# EAGLE design axiom_beta_power_adapter (EAGLE 7.0.0)
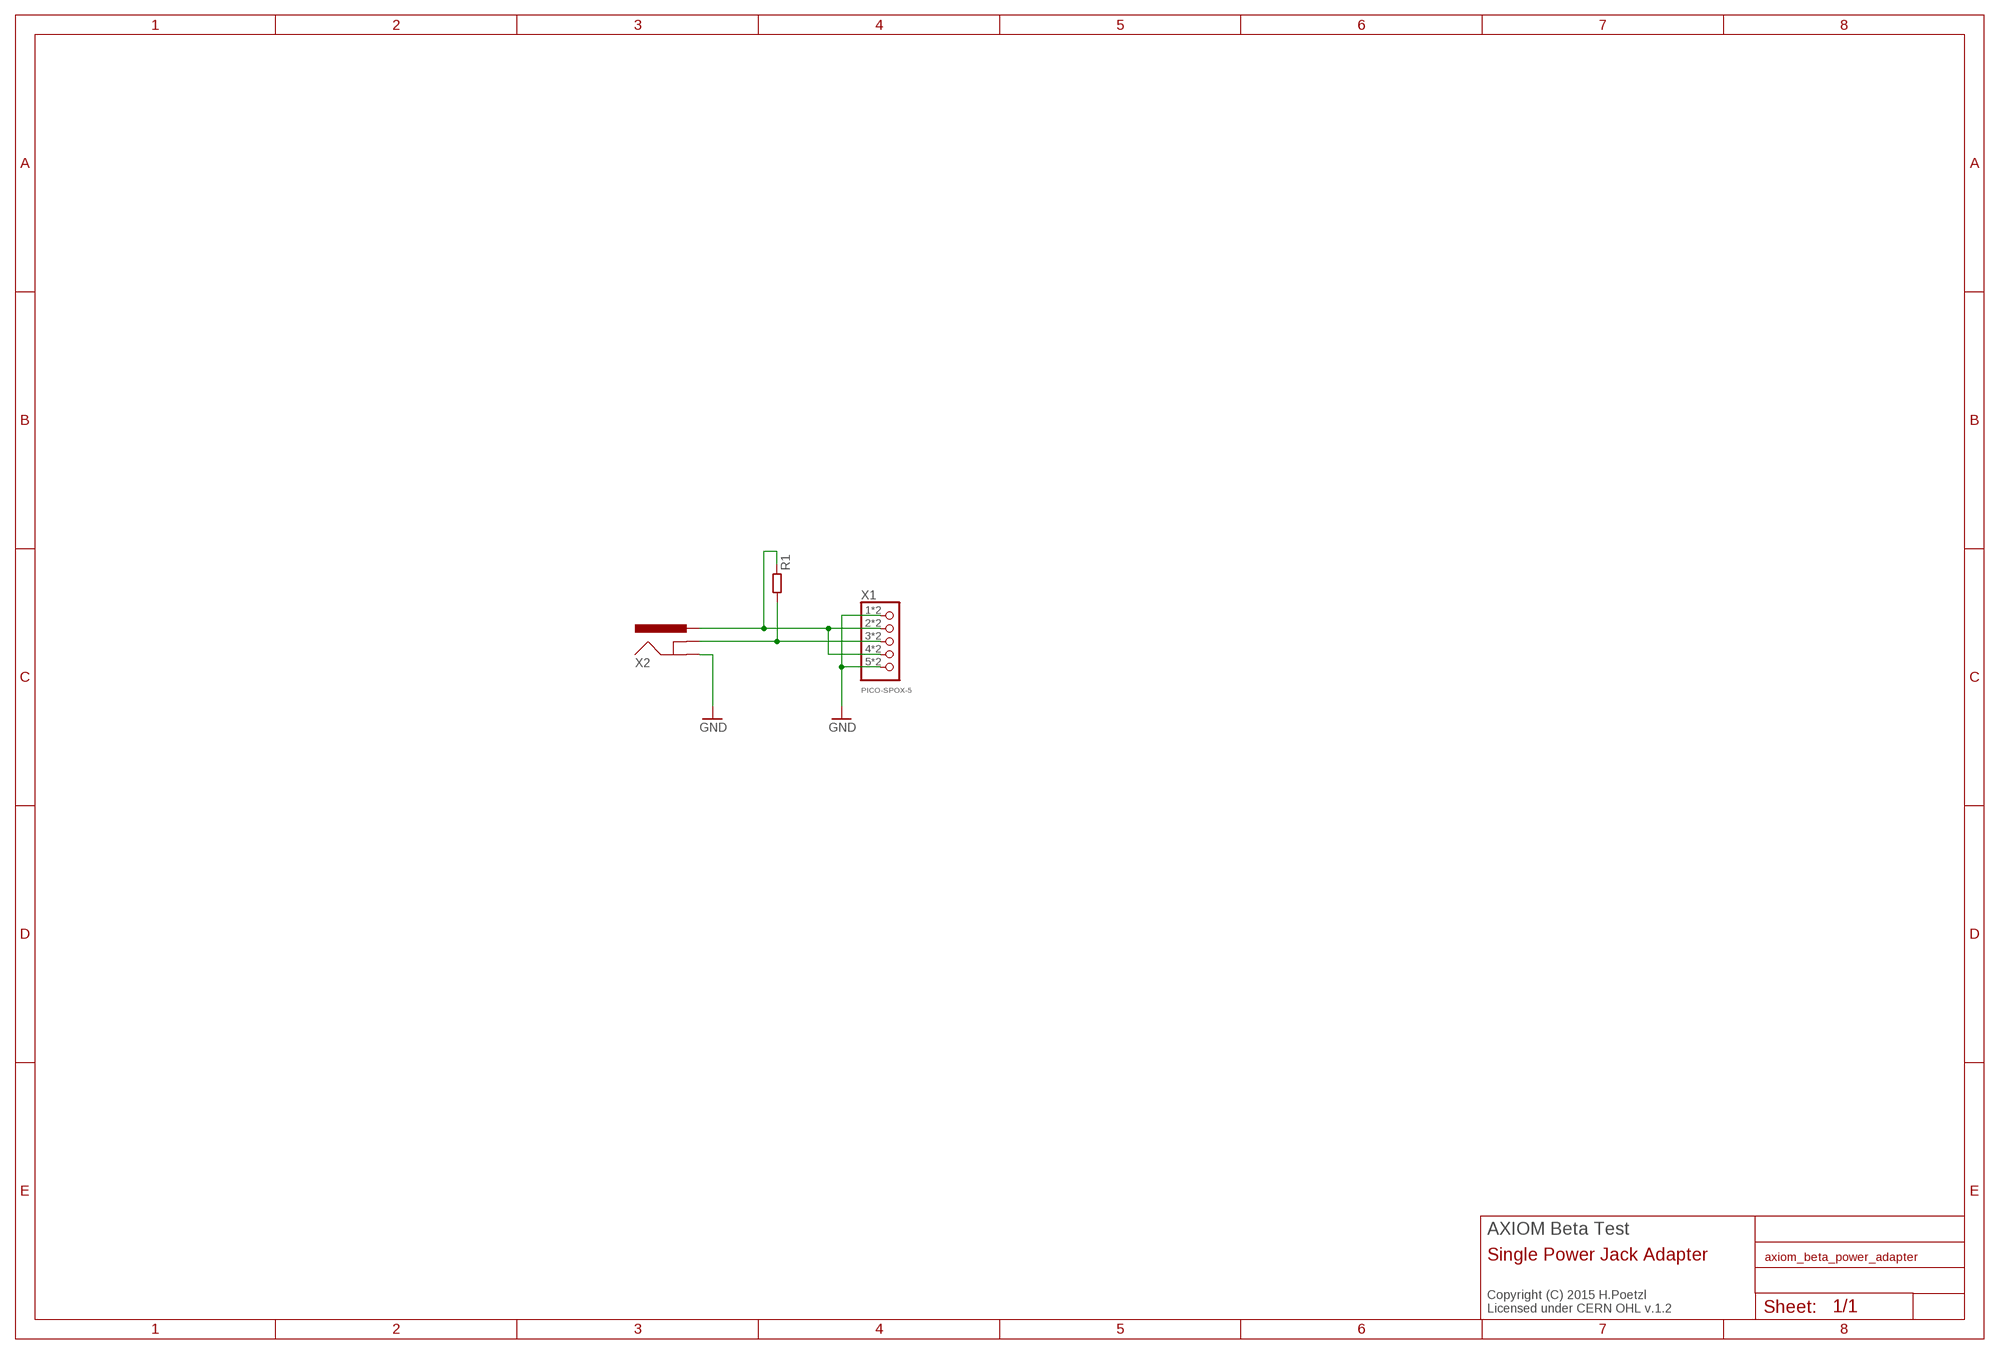
[diagram p0: schematic, sheet 1]

## Parts
R1  R0402-B  [0402-B]
X1  PICO-SPOX-5  [PICO-SPOX-5]
X2  POWER_JACKPTH_N  [POWER_JACK_PTH_NARROW]

## Nets
BETA_5V: R1.1 X1.2 X1.2A X1.4 X1.4A X2.PWR
GND: X1.1 X1.1A X1.5 X1.5A X2.GND
VIN: R1.2 X1.3 X1.3A X2.SHUNT(GNDBREAK)

## Notes on the sheet
- AXIOM Beta Test
- Single Power Jack Adapter
- Copyright (C) 2015 H.Poetzl
  Licensed under CERN OHL v.1.2

## Library data of the parts
R1 = generic-rcl:R
X1 = pico-spox:PICO-SPOX-5
X2 = power_jack:POWER_JACK: RASM712PX Right Angle SMT Mount DC Power Jack, pin size 0.100"(2.5mm), with locating post Switchcraft.com

## Net classes
1 LVDS: width 0.152 mm, drill 0.254 mm, clearance 0.152 mm

## Board
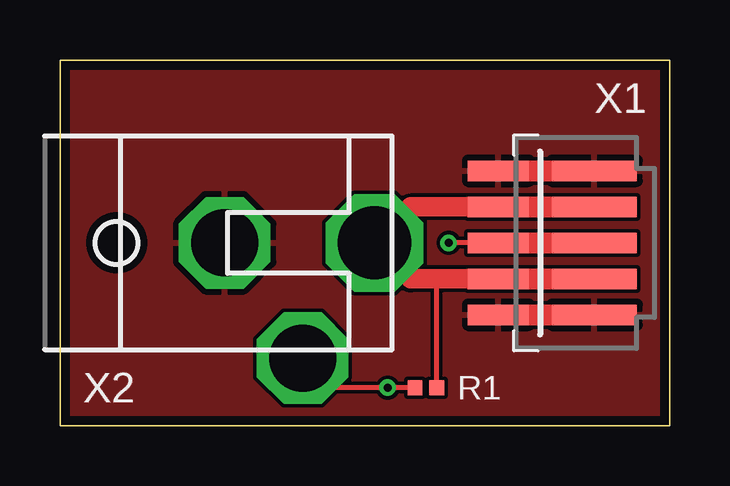
[diagram p1: board, top side]
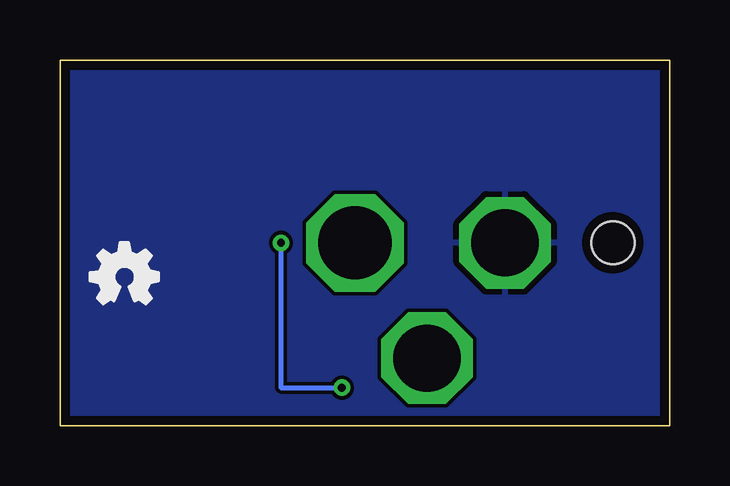
[diagram p2: board, bottom side, seen from below]

Size 25.4 x 15.24 mm. Coordinates in mm from the lower left corner, seen from the top.
Outline: 0,0 0,15.24 25.4,15.24 25.4,0 0,0
Copper layers (1*16): Top 0.0356mm / dielectric 1.5011mm / Bottom 0.0356mm
Design rules "OSHPark-2layer-tuned": minimum track width 6mil, minimum drill 13mil, track to track 6mil, track to pad 6mil, pad to pad 6mil, via to via 6mil, smd to smd 6mil, copper to edge 15mil, drill to drill 6mil, minimum pad ring 7mil, minimum via ring 7mil, stop-mask expansion 4mil, vias tented up to drill 15mil, thermal gap 10mil

### Footprints (pad centres in the part's own frame; a part is rotated, then mirrored left to right if it is on the bottom)
0402-B = smd 0.62 x 0.62: 1 -0.45,0; 2 0.45,0
PICO-SPOX-5 = smd 0.85 x 2.55: 1 -3,-6.5; 2 -1.5,-6.5; 3 0,-6.5; 4 1.5,-6.5; 5 3,-6.5 | smd 0.85 x 3.55: 1A -3,-2.5; 2A -1.5,-2.5; 3A 0,-2.5; 4A 1.5,-2.5; 5A 3,-2.5
POWER_JACK_PTH_NARROW = drill 2.794 octagon: GND 0,7.493; SHUNT 4.801,10.744 | drill 3.048 octagon: PWR 0,13.741 | hole 1.778: 0,2.994

### Placement (x,y rotation side)
LOGO1  OSHW_LOGO_FILLX0100-NT  [OSHW_FILLX100_NOTEXT]  24.13,5.08 0 bottom
R1  15.24,1.59 180 top
X1  24.77,7.62 270 top
X2  -0.64,7.62 270 top

### Tracks (layer width: path | path; a pad name or v marks a point on that pad's centre or on a via)
BETA_5V
  Top 0.152: 15.69,5.93 15.88,6.12
  Top 0.203: R1.1 15.69,5.93
  Top 0.813: X1.4A X1.4 15.88,6.12 14.61,6.12 X2.PWR 14.61,9.12 X1.2 X1.2A
GND
  pour Top: 0,0 0,15.24 25.4,15.24 25.4,0
  pour Bottom: 0,0 0,15.24 25.4,15.24 25.4,0
VIN  (via drill 0.33 pad 0.25)
  Top 0.203: X1.3A X1.3 v16.19,7.62 | R1.2 v13.65,1.59 11.34,1.59 X2.SHUNT
  Bottom 0.203: v16.19,7.62 16.19,1.59 v13.65,1.59

### Text on the board
_tSilk: 5V 5A
_bSilk: Copyright (C) 2015 / Herbert Pötzl | AXIOM Beta / Power Adapter | V0.2 / R1.0 | Licensed / under CERN / OHL v.1.2
tEngrave: BETA POWER ADAPTER / TOP SIDE V0.2 R1.0
bEngrave: BETA POWER ADAPTER / BOTTOM SIDE V0.2 R1.0